# EAGLE design Simon-2023 (EAGLE 9.6.2)
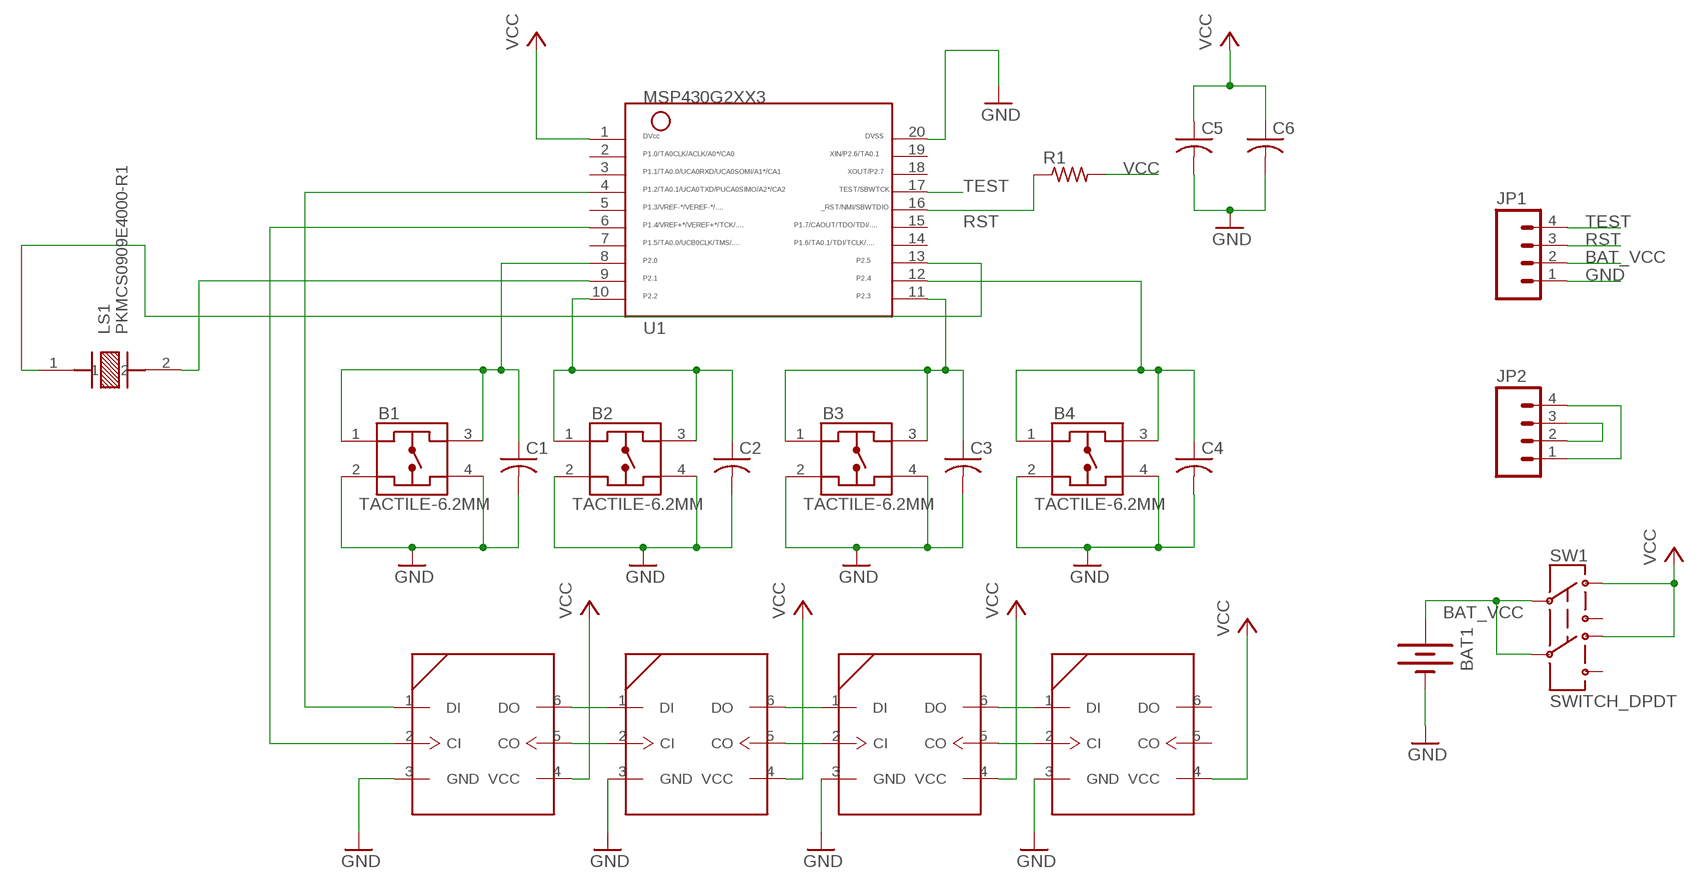
[diagram p0: schematic, sheet 1]

## Parts
B1  TACTILE-6.2MM  [222_AM]
B2  TACTILE-6.2MM  [222_AM]
B3  TACTILE-6.2MM  [222_AM]
B4  TACTILE-6.2MM  [222_AM]
BAT1  BATTERY  [BATTERY_PACK_2AA]
C1  C-USC0603  [C0603]
C2  C-USC0603  [C0603]
C3  C-USC0603  [C0603]
C4  C-USC0603  [C0603]
C5  C-USC1206  [C1206]
C6  C-USC0603  [C0603]
JP1  M04LOCK  [1X04_LOCK]
JP2  M04LOCK  [1X04_LOCK]
LED1  APA102  [5050]
LED2  APA102  [5050]
LED3  APA102  [5050]
LED4  APA102  [5050]
LS1  PKMCS0909E4000-R1  [XDCR_PKMCS0909E4000-R1]
R1  R-US_R1206  [R1206]
SW1  SWITCH_DPDT  [JS_DPDT_TH]
U1  MSP430G2XX3TSSOP  [PW20]

## Nets
BAT_VCC: BAT1.3V(+) JP1.2 SW1.2 SW1.5
GND: B1.2 B1.4 B2.2 B2.4 B3.2 B3.4 B4.2 B4.4 BAT1.GND(-) C1.2 C2.2 C3.2 C4.2 C5.2 C6.2 JP1.1 LED1.3(GND) LED2.3(GND) LED3.3(GND) LED4.3(GND) U1.20
N$1: LED1.6(DO) LED2.1(DI)
N$2: LED1.5(CO) LED2.2(CI)
N$3: LED2.6(DO) LED3.1(DI)
N$4: LED2.5(CO) LED3.2(CI)
N$5: LED3.6(DO) LED4.1(DI)
N$6: LED3.5(CO) LED4.2(CI)
N$7: LED1.1(DI) U1.4
N$8: LED1.2(CI) U1.6
N$9: B2.1 B2.3 C2.1 U1.10
N$10: LS1.2 U1.9
N$11: LS1.1 U1.13
N$12: B1.1 B1.3 C1.1 U1.8
N$13: JP2.1 JP2.4
N$14: JP2.2 JP2.3
N$16: B3.1 B3.3 C3.1 U1.11
N$20: B4.1 B4.3 C4.1 U1.12
RST: JP1.3 R1.1 U1.16
TEST: JP1.4 U1.17
VCC: C5.1 C6.1 LED1.4(VCC) LED2.4(VCC) LED3.4(VCC) LED4.4(VCC) R1.2 SW1.1 SW1.4 U1.1
Unconnected: LED4.5(CO) LED4.6(DO) SW1.3 SW1.6 U1.2 U1.3 U1.5 U1.7 U1.14 U1.15 U1.18 U1.19

## Library data of the parts
B1-B4 = ELEC327:TACTILE-6.2MM: CTS 6.2 x 6.2 mm Tactile Switch CTS Part Number 222AMVBAR (SMD) Digikey part CT3088TR-ND
BAT1 = ELEC327:BATTERY: Battery Holders Various common sizes : AA, AAA, 20mm coin cell and 12mm coin cell. 20MM_4LEGS, BATT-10373
C1-C6 = rcl:C-US: CAPACITOR, American symbol; SPICEPREFIX: C
JP1 JP2 = SparkFun:M04: Header 4 Standard 4-pin 0.1" header. Use with straight break away headers (SKU : PRT-00116), right angle break away headers (PRT-00553), swiss pins (PRT-00743), machine pins (PRT-00117), and female headers (PRT-00115). Molex polarized connector foot print use with SKU : PRT-08231 with associated crimp pins and housings. 1MM SMD Version SKU: PRT-10208
LED1-LED4 = ELEC327:APA102: APA102 SPI RGB LED APA102 is a chainable RGB LED. The control protocol is a variant of SPI.
LS1 = ELEC327:PKMCS0909E4000-R1: Audio Sounder Piezo Solder Pad Surface Mount; DESCRIPTION: Buzzers Transducer, Externally Driven Piezo 1.5V 4kHz 65dB @ 1.5V, 10cm Surface Mount Solder Pads; DIGI-KEY_PART_NUMBER: 490-9647-1-ND; DIGI-KEY_PURCHASE_URL: https://www.digikey.com/product-detail/en/murata-electronics/PKMCS0909E4000-R1/490-9647-1-ND/4878401?utm_source=snapeda&utm_medium=aggregator&utm_campaign=symbol; MF: Murata; MP: PKMCS0909E4000-R1; PACKAGE: 2010 Murata
R1 = resistor:R-US_: RESISTOR, American symbol
SW1 = ELEC327:SWITCH_DPDT
U1 = ELEC327:MSP430G2XX3: MSP430G2XX3 PDIP (N) 20 Pin Package

## Board
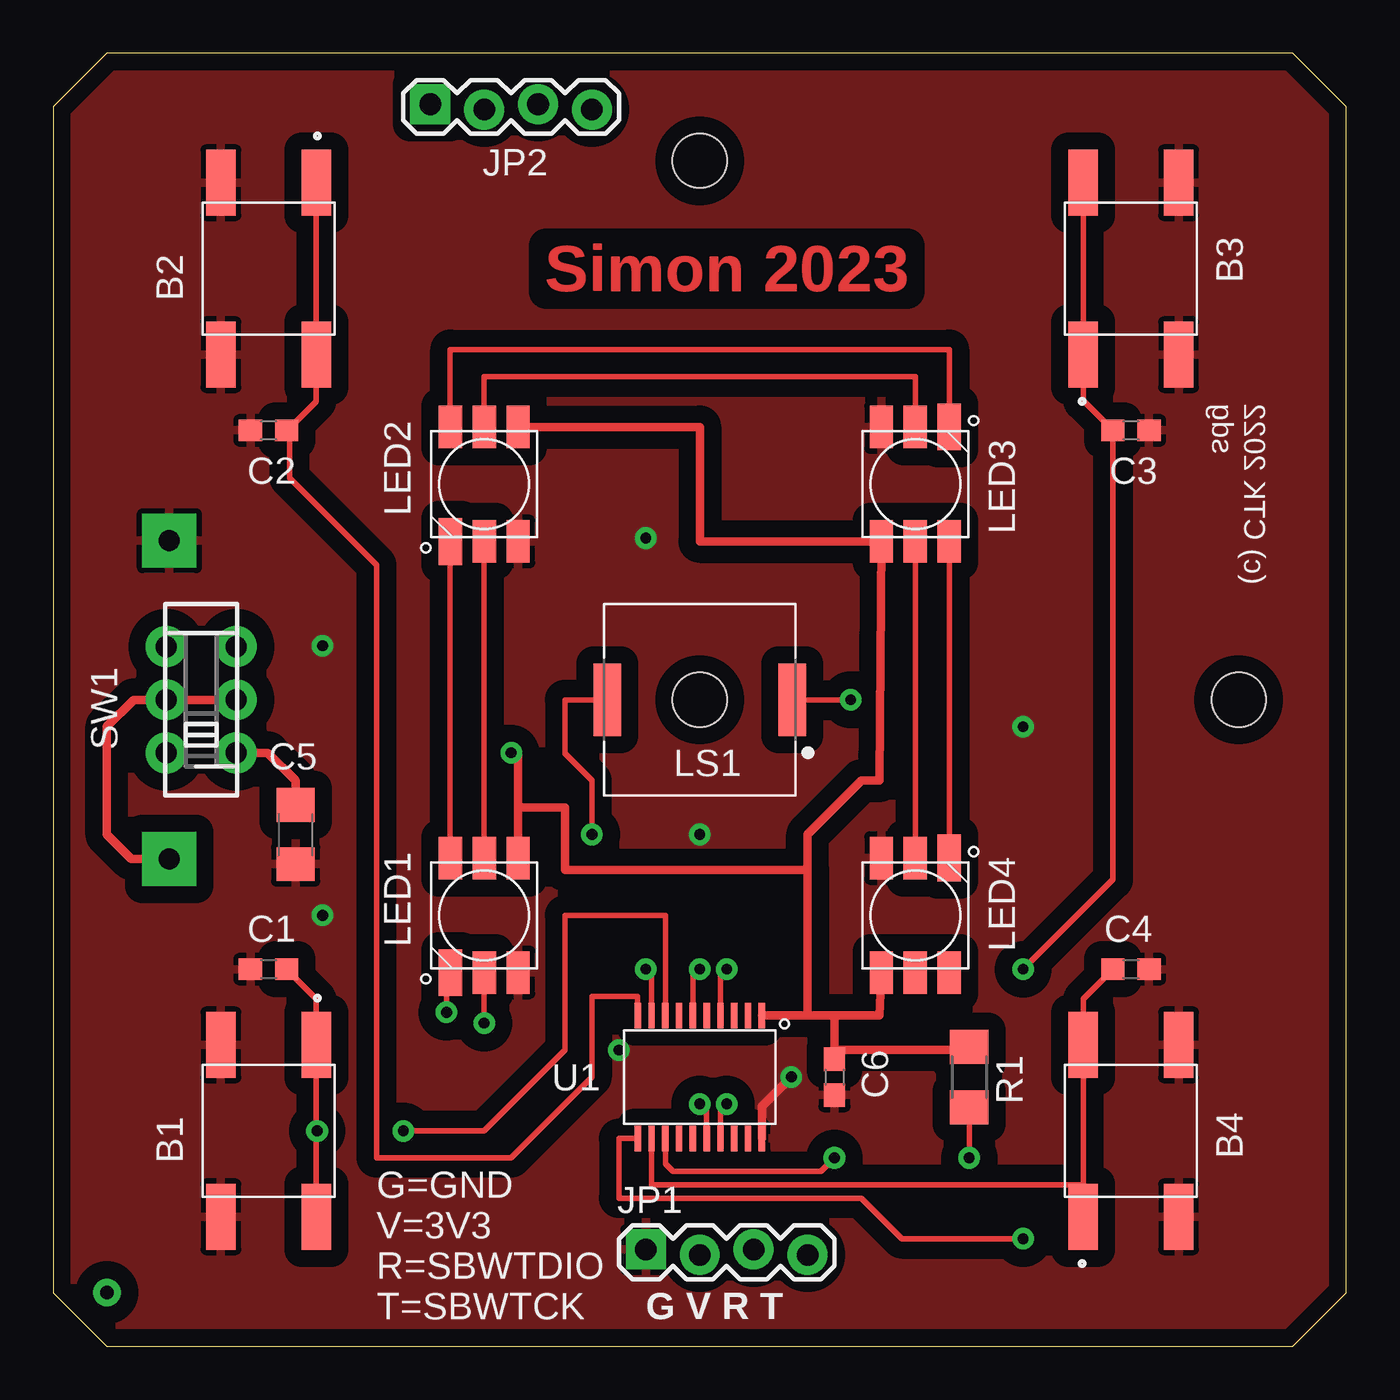
[diagram p1: board, top side]
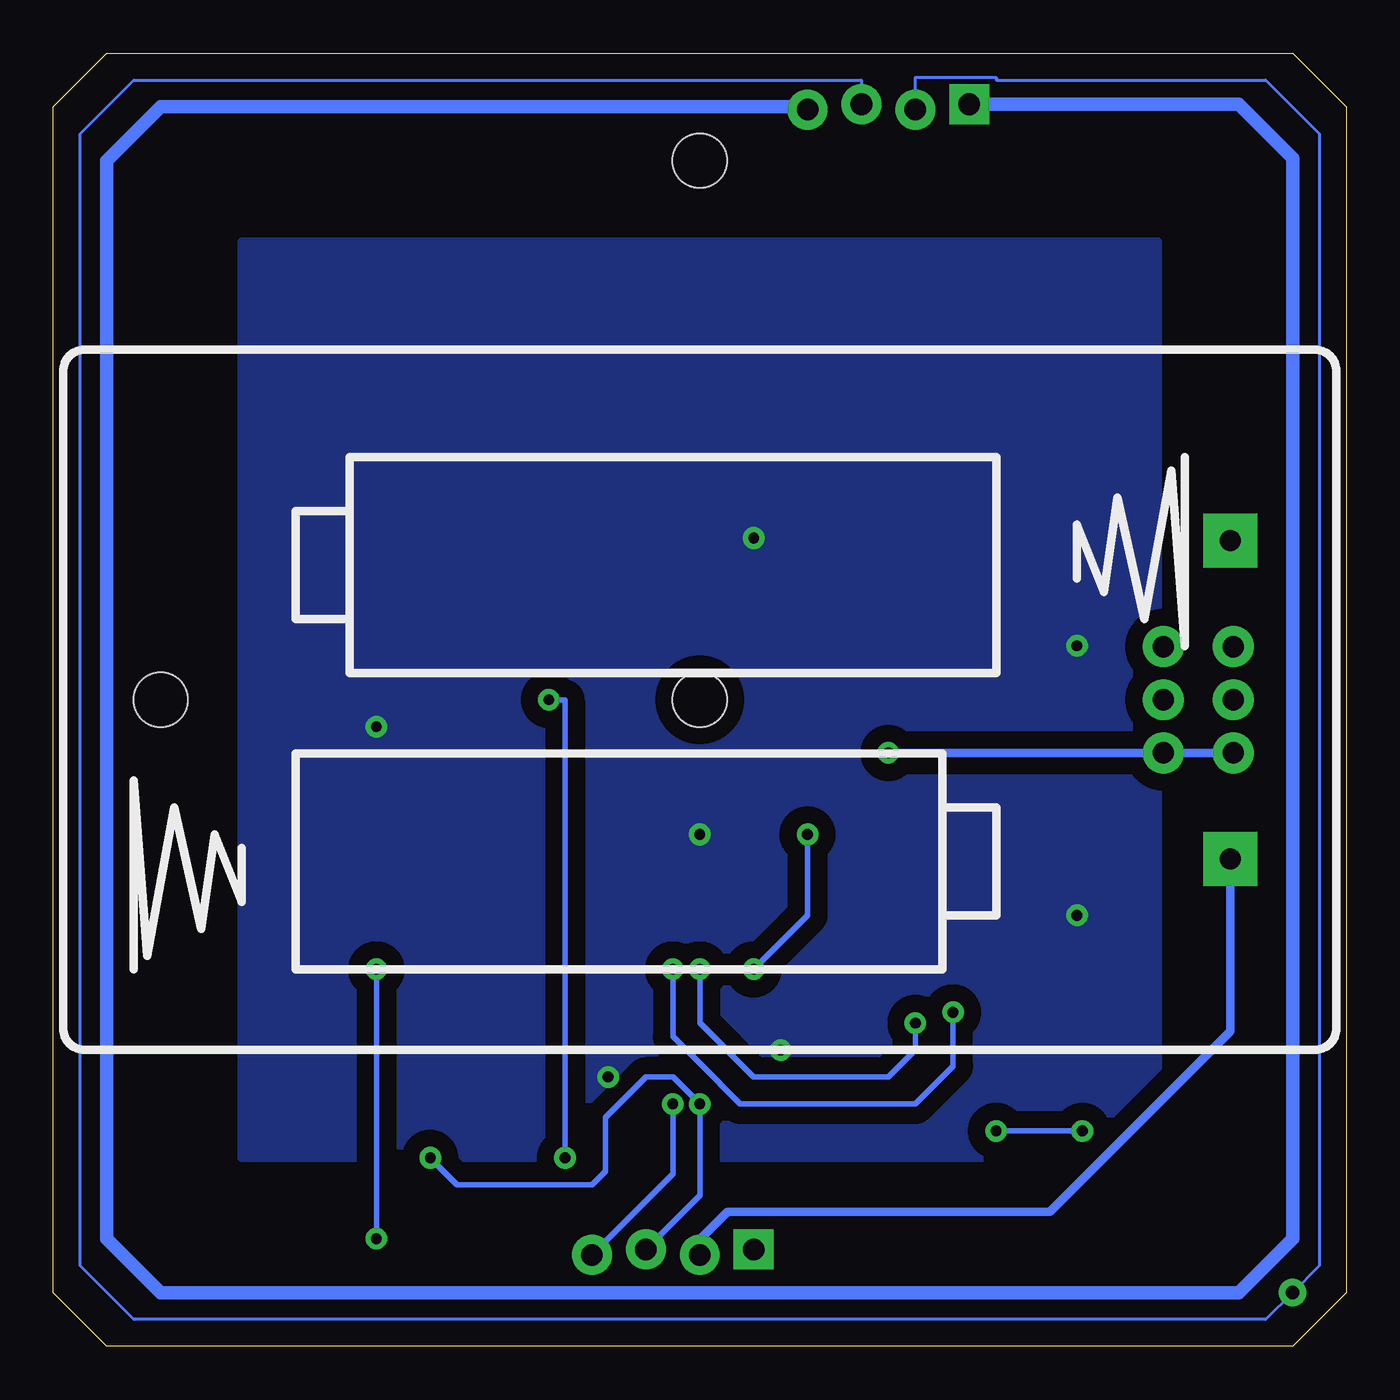
[diagram p2: board, bottom side, seen from below]

Size 60.96 x 60.96 mm. Coordinates in mm from the lower left corner, seen from the top.
Outline: 0,58.42 0,2.54 2.54,0 58.42,0 60.96,2.54 60.96,58.42 58.42,60.96 2.54,60.96 0,58.42
Copper layers (1*16): Top 0.035mm / dielectric 1.5mm / Bottom 0.035mm
Design rules "AdvancedCircuitsBarebones": minimum track width 6mil, minimum drill 20mil, track to track 6mil, track to pad 6mil, pad to pad 6mil, via to via 6mil, smd to smd 6mil, copper to edge 10mil, drill to drill 6mil, minimum pad ring 12mil, minimum via ring 10mil, stop-mask expansion 4mil, vias tented up to drill 25mil, thermal gap 10mil
Holes 2.54 mm at 30.48,30.48 30.48,55.88 55.88,30.48

### Footprints (pad centres in the part's own frame; a part is rotated, then mirrored left to right if it is on the bottom)
222_AM = smd 3.1 x 1.4: 1 -4.05,2.25; 2 -4.05,-2.25; 3 4.05,2.25; 4 4.05,-2.25
BATTERY_PACK_2AA = drill 1 pad 2.54 square: 3V 7.5,25; GND -7.5,25
C0603 = smd 1.1 x 1: 1 -0.85,0; 2 0.85,0
C1206 = smd 1.6 x 1.8: 1 -1.4,0; 2 1.4,0
1X04_LOCK = drill 1.016 pad 1.88 square: 1 0,0.127 | drill 1.016 pad 1.88: 2 2.54,-0.127; 3 5.08,0.127; 4 7.62,-0.127
5050 = smd 2.2 x 1.1: 1 -2.7,1.6 | smd 2 x 1.1: 2 -2.7,0; 3 -2.7,-1.6; 4 2.7,-1.6; 5 2.7,0; 6 2.7,1.6
XDCR_PKMCS0909E4000-R1 = smd 1.3 x 3.4: 1 -4.35,0; 2 4.35,0
R1206 = smd 1.6 x 1.803: 1 -1.422,0; 2 1.422,0
JS_DPDT_TH = drill 1 pad 1.93: 1 -2.5,-1.65; 2 0,-1.65; 3 2.5,-1.65; 4 -2.5,1.65; 5 0,1.65; 6 2.5,1.65
PW20 = smd 0.3 x 1.2: 1 -2.925,-2.9; 2 -2.275,-2.9; 3 -1.625,-2.9; 4 -0.975,-2.9; 5 -0.325,-2.9; 6 0.325,-2.9; 7 0.975,-2.9; 8 1.625,-2.9; 9 2.275,-2.9; 10 2.925,-2.9; 11 2.925,2.9; 12 2.275,2.9; 13 1.625,2.9; 14 0.975,2.9; 15 0.325,2.9; 16 -0.325,2.9; 17 -0.975,2.9; 18 -1.625,2.9; 19 -2.275,2.9; 20 -2.925,2.9

### Placement (x,y rotation side)
B1  10.16,10.16 270 top
B2  10.16,50.8 270 top
B3  50.8,50.8 90 top
B4  50.8,10.16 90 top
BAT1  30.48,30.48 270 bottom
C1  10.16,17.78 180 top
C2  10.16,43.18 180 top
C3  50.8,43.18 0 top
C4  50.8,17.78 0 top
C5  11.43,24.13 270 top
C6  36.83,12.7 270 top
JP1  27.94,4.45 0 top
JP2  17.78,58.42 0 top
LED1  20.32,20.32 90 top
LED2  20.32,40.64 90 top
LED3  40.64,40.64 270 top
LED4  40.64,20.32 270 top
LS1  30.48,30.48 180 top
R1  43.18,12.7 90 top
SW1  6.99,30.48 90 top
U1  30.48,12.7 180 top

### Tracks (layer width: path | path; a pad name or v marks a point on that pad's centre or on a via)
BAT_VCC
  Top 0.406: SW1.2 SW1.5 3.81,30.48 2.54,29.21 2.54,24.13 3.69,22.98 BAT1.3V
  Bottom 0.406: BAT1.3V 5.48,14.84 13.97,6.35 29.18,6.35 30.48,5.05 JP1.2
GND  (via drill 0.51)
  Top 0.406: v34.8,12.7 33.41,11.31 U1.20
  other vias: 45.72,29.21 27.94,38.1 30.48,24.13 12.7,20.32 12.7,33.02 26.67,13.97
  pour Top (isolate 0.813): 60.96,60.96 0,60.96 0,0 60.96,0
  pour Bottom (isolate 0.813): 52.07,8.89 52.07,52.07 8.89,52.07 8.89,8.89
N$1
  Top 0.254: LED1.6 LED2.1
N$2
  Top 0.254: LED1.5 LED2.2
N$3
  Top 0.254: LED2.6 18.72,46.99 42.24,46.99 LED3.1
N$4
  Top 0.254: LED3.2 40.64,45.72 20.32,45.72 LED2.5
N$5
  Top 0.254: LED3.6 LED4.1
N$6
  Top 0.254: LED3.5 LED4.2
N$7  (via drill 0.51)
  Top 0.254: U1.4 31.45,17.48 v31.75,17.78 | v18.54,15.75 18.54,18.09 LED1.1
  Bottom 0.254: v31.75,17.78 31.75,14.61 30.48,13.34 28.57,11.43 20.32,11.43 18.54,13.21 v18.54,15.75
N$8  (via drill 0.51)
  Top 0.254: LED1.2 v20.32,15.24 | U1.6 30.16,17.45 v30.48,17.78
  Bottom 0.254: v30.48,17.78 30.48,15.24 27.94,12.7 21.59,12.7 20.32,13.97 v20.32,15.24
N$9
  Top 0.254: B2.1 B2.3 12.41,44.54 11.14,43.27 | 11.14,43.27 C2.1 | U1.10 27.55,16.51 25.4,16.51 25.4,12.7 21.59,8.89 15.24,8.89 15.24,36.83 11.14,40.93 11.14,43.27
N$10  (via drill 0.51)
  Top 0.254: U1.9 28.2,17.52 v27.94,17.78 | v25.4,24.13 25.4,26.67 24.13,27.94 24.13,30.48 LS1.2
  Bottom 0.254: v25.4,24.13 25.4,20.32 v27.94,17.78
N$11  (via drill 0.51)
  Top 0.254: U1.13 28.86,8.61 29.21,8.26 36.2,8.26 v36.83,8.89 | LS1.1 v37.59,30.48
  Bottom 0.254: v36.83,8.89 36.83,30.48 v37.59,30.48
N$12  (via drill 0.51)
  Top 0.254: U1.8 28.86,20.32 24.13,20.32 24.13,13.97 20.32,10.16 v16.51,10.16 | 12.41,10.16 B1.1 12.41,16.38 C1.1 | 12.41,10.16 B1.3 | 12.41,10.16 v12.45,10.16
  Bottom 0.254: v16.51,10.16 v12.45,10.16
N$13
  Bottom 0.406: JP2.4 25.4,58.42
  Bottom 0.635: JP2.1 5.08,58.55 2.54,56.01 2.54,5.08 5.08,2.54 55.88,2.54 58.42,5.08 58.42,55.88 55.88,58.42 25.4,58.42
N$14  (via drill 0.65 pad 1.3)
  Bottom 0.152: JP2.3 22.86,59.69 57.15,59.69 59.69,57.15 59.69,3.81 57.15,1.27 3.81,1.27 v2.54,2.54 1.27,3.81 1.27,57.15 3.81,59.69 16.51,59.69 16.51,59.82 20.32,59.82 JP2.2
N$16  (via drill 0.51)
  Top 0.254: v45.72,17.78 49.53,21.59 49.85,21.91 49.95,22.01 C3.1 48.55,44.58 B3.1 B3.3 | v45.72,5.08 40.01,5.08 38.1,6.99 26.67,6.99 26.67,9.8 U1.11
  Bottom 0.254: v45.72,17.78 v45.72,5.08
N$20
  Top 0.254: U1.12 28.2,7.62 48.55,7.62 B4.1 B4.3 48.55,16.38 C4.1
RST  (via drill 0.51)
  Top 0.254: U1.16 30.8,11.11 v30.48,11.43 | v43.18,8.89 R1.1
  Bottom 0.254: JP1.3 30.48,7.11 v30.48,11.43 31.75,12.7 33.02,12.7 34.92,10.79 34.92,8.26 35.56,7.62 41.91,7.62 v43.18,8.89
TEST  (via drill 0.51)
  Top 0.254: U1.17 31.45,11.13 v31.75,11.43
  Bottom 0.254: JP1.4 31.75,8.13 v31.75,11.43
VCC  (via drill 0.51)
  Top 0.406: U1.1 35.56,15.6 | 35.56,15.6 36.83,15.6 | 36.83,15.6 38.94,15.6 LED4.4 | 35.56,22.47 24.13,22.47 24.13,25.4 21.92,25.4 | 35.56,22.47 35.56,15.6 | 35.56,22.47 35.56,24.13 38.1,26.67 38.94,26.67 LED3.4 30.48,37.94 30.48,43.34 LED2.4 | LED1.4 21.92,25.4 | v21.59,27.98 21.92,27.98 21.92,25.4 | SW1.1 10.12,27.98 11.43,26.67 C5.1 | C6.1 36.83,13.97 | 36.83,13.97 36.83,15.6 | R1.2 43.03,13.97 36.83,13.97
  Bottom 0.406: v21.59,27.98 SW1.1 SW1.4

### Text on the board
Top: Simon 2023
tNames: (c) CTK 2022 / sdg | G=GND / V=3V3 / R=SBWTDIO / T=SBWTCK | G V R T
tStop: Simon 2023